# EAGLE design M660A (EAGLE 6.6.0)
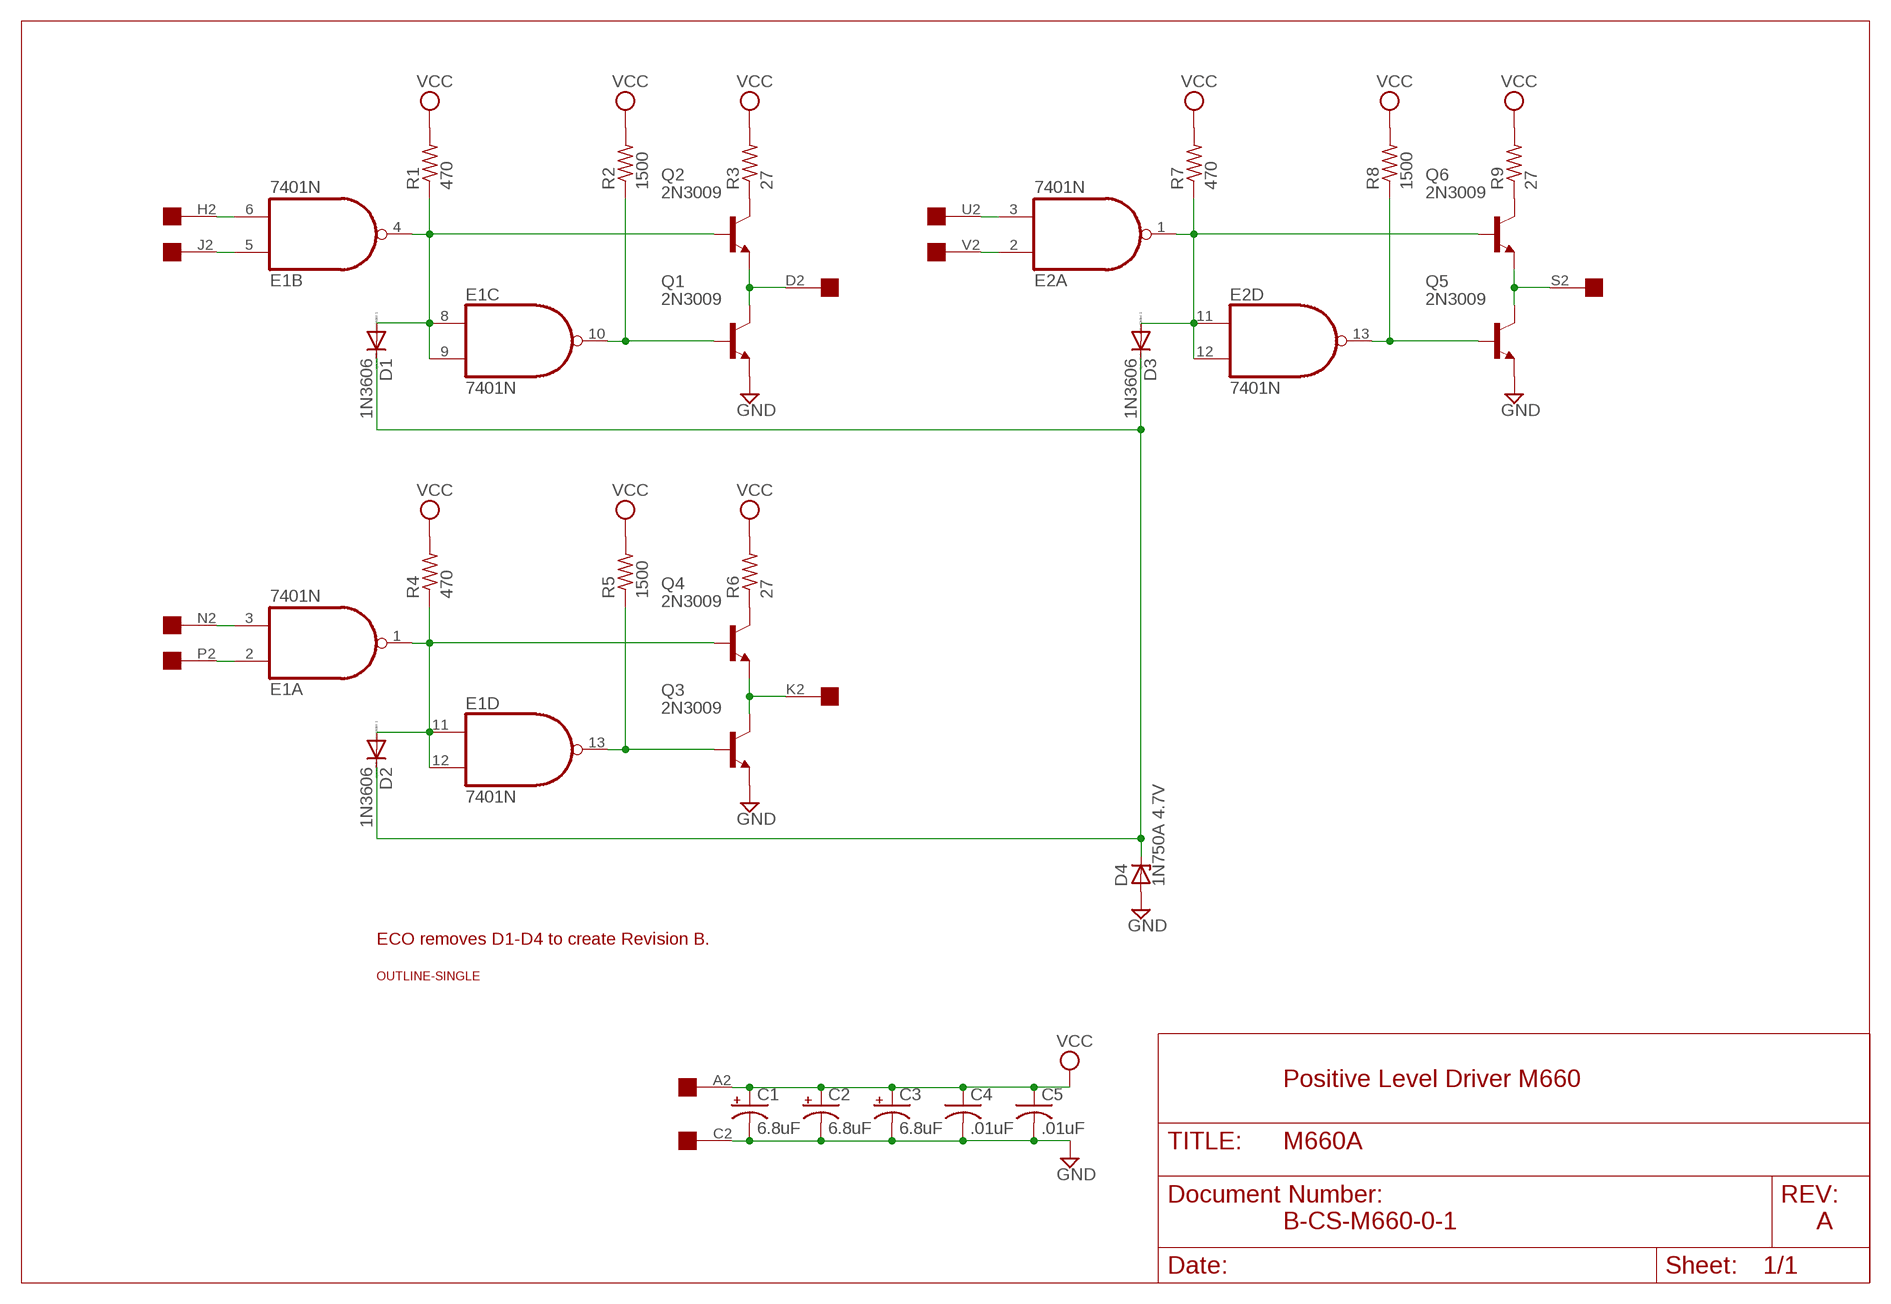
[diagram p0: schematic, sheet 1]

## Parts
C1  6.8uF  CPOL-USE15-5AXIAL  [E15-5]
C2  6.8uF  CPOL-USE15-5AXIAL  [E15-5]
C3  6.8uF  CPOL-USE15-5AXIAL  [E15-5]
C4  .01uF  C-US050-025X075  [C050-025X075]
C5  .01uF  C-US050-025X075  [C050-025X075]
D1  1N3606  1N4148DO35-10  [DO35-10]
D2  1N3606  1N4148DO35-10  [DO35-10]
D3  1N3606  1N4148DO35-10  [DO35-10]
D4  1N750A 4.7V  ZENER-DIODEDO35Z10  [DO35Z10]
E1  7401N  74LS01N  [DIL14]
E2  7401N  74LS01N  [DIL14]
Q1  2N3009  2N2219  [TO5]
Q2  2N3009  2N2219  [TO5]
Q3  2N3009  2N2219  [TO5]
Q4  2N3009  2N2219  [TO5]
Q5  2N3009  2N2219  [TO5]
Q6  2N3009  2N2219  [TO5]
R1  470  R-US_0207/10  [0207/10]
R2  1500  R-US_0207/10  [0207/10]
R3  27  R-US_0411/15  [0411/15]
R4  470  R-US_0207/10  [0207/10]
R5  1500  R-US_0207/10  [0207/10]
R6  27  R-US_0411/15  [0411/15]
R7  470  R-US_0207/10  [0207/10]
R8  1500  R-US_0207/10  [0207/10]
R9  27  R-US_0411/15  [0411/15]
U$1  OUTLINE-SINGLE  [SINGLE]
U$3  EDGE-1  [EDGE-CON1]

## Nets
GND [Supply]: C1.- C2.- C3.- C4.2 C5.2 D4.A Q1.1(E) Q3.1(E) Q5.1(E) U$3.C2
N$1: E1.5(B:I0) U$3.J2
N$2: E1.6(B:I1) U$3.H2
N$3: D1.A E1.4(B:O) E1.8(C:I0) E1.9(C:I1) Q2.2(B) R1.1
N$4: E1.10(C:O) Q1.2(B) R2.1
N$5: Q2.3(C) R3.1
N$6: Q1.3(C) Q2.1(E) U$3.D2
N$7: E1.2(A:I0) U$3.P2
N$8: E1.3(A:I1) U$3.N2
N$9: D2.A E1.1(A:O) E1.11(D:I0) E1.12(D:I1) Q4.2(B) R4.1
N$10: E1.13(D:O) Q3.2(B) R5.1
N$11: Q4.3(C) R6.1
N$12: Q3.3(C) Q4.1(E) U$3.K2
N$13: E2.2(A:I0) U$3.V2
N$14: E2.3(A:I1) U$3.U2
N$15: D3.A E2.1(A:O) E2.11(D:I0) E2.12(D:I1) Q6.2(B) R7.1
N$16: E2.13(D:O) Q5.2(B) R8.1
N$17: Q6.3(C) R9.1
N$18: Q5.3(C) Q6.1(E) U$3.S2
N$19: D1.C D2.C D3.C D4.C
VCC [Supply]: C1.+ C2.+ C3.+ C4.1 C5.1 R1.2 R2.2 R3.2 R4.2 R5.2 R6.2 R7.2 R8.2 R9.2 U$3.A2
Unconnected: E2.4(B:O) E2.5(B:I0) E2.6(B:I1) E2.8(C:I0) E2.9(C:I1) E2.10(C:O) U$3.B2 U$3.E2 U$3.F2 U$3.L2 U$3.M2 U$3.R2 U$3.T2

## Notes on the sheet
- ECO removes D1-D4 to create Revision B.
- Positive Level Driver M660
- B-CS-M660-0-1 | A

## Power pins joined to a net without a drawn wire
GND: E1.7(P:GND) E2.7(P:GND)
VCC: E1.14(P:VCC) E2.14(P:VCC)

## Library data of the parts
C1-C3 = rcl:CPOL-US: POLARIZED CAPACITOR, American symbol
C4 C5 = rcl:C-US: CAPACITOR, American symbol
D1-D3 = diode:1N4148: DIODE high speed (Philips)
D4 = diode:ZENER-DIODE: Z-Diode
E1 E2 = 74xx-us:74*01: Quad 2-input NAND gate, open collector
Q1-Q6 = transistor-npn:2N2219: NPN Transistor
R1-R9 = rcl:R-US_: RESISTOR, American symbol
U$1 = dec-con:OUTLINE-*: Board outlines for DEC boards.
U$3 = dec-con:EDGE-1: Single-Sided DEC Edge Connector -- (side 2)

## Net classes
1 Supply: width 0.813 mm

## Board
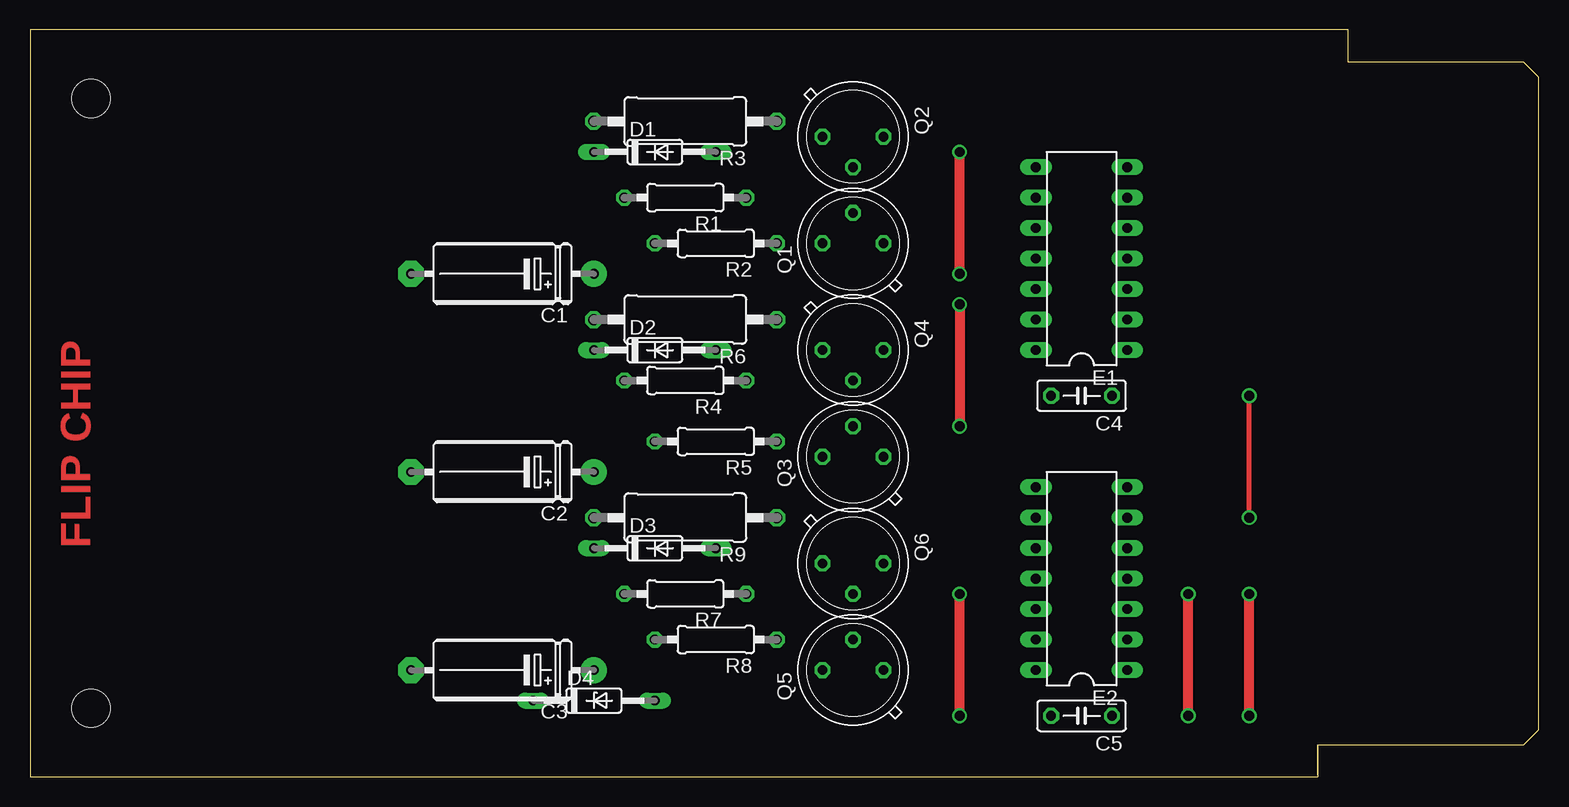
[diagram p1: board, top side]
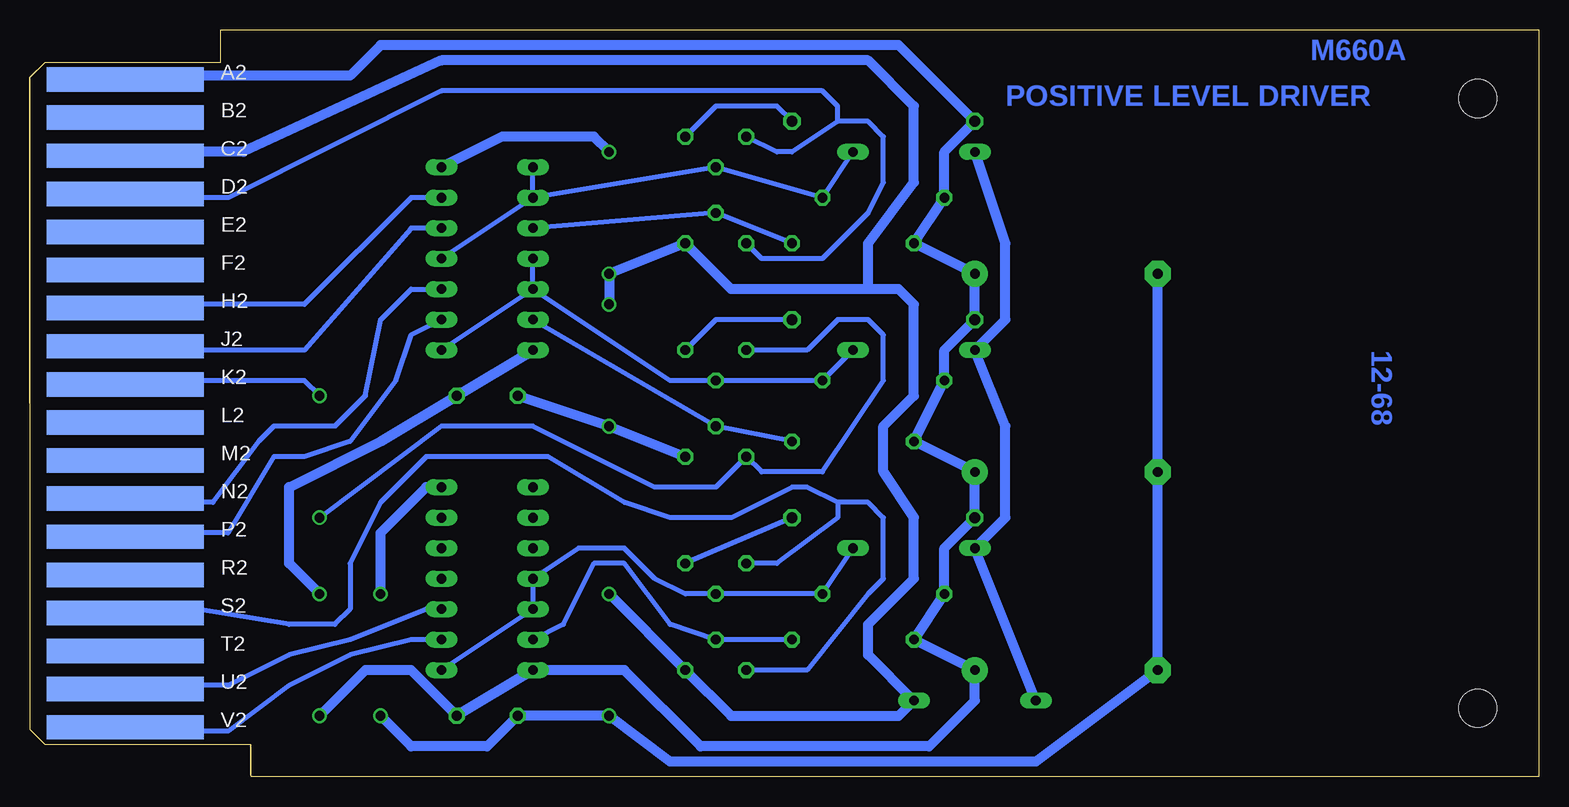
[diagram p2: board, bottom side, seen from below]

Size 125.73 x 62.23 mm. Coordinates in mm from the lower left corner, seen from the top.
Copper layers (1+16): Top 0.035mm / dielectric 1.5mm / Bottom 0.035mm
Design rules "16mils": minimum track width 16mil, minimum drill 32mil, track to track 15mil, track to pad 10mil, pad to pad 10mil, via to via 10mil, smd to smd 10mil, copper to edge 13mil, drill to drill 10mil, minimum pad ring 10mil, minimum via ring 8mil, stop-mask expansion 0mil, vias tented up to drill 0mil, thermal gap 10mil

### Footprints (pad centres in the part's own frame; a part is rotated, then mirrored left to right if it is on the bottom)
E15-5 = drill 0.813 pad 2.159: + -7.62,0 | drill 0.813 pad 2.159 octagon: - 7.62,0
C050-025X075 = drill 0.813 octagon: 1 -2.54,0; 2 2.54,0
DO35-10 = drill 0.813 long: A 5.08,0; C -5.08,0
DO35Z10 = drill 0.813 long: A 5.08,0; C -5.08,0
DIL14 = drill 0.813 long: 1 -7.62,-3.81; 2 -5.08,-3.81; 3 -2.54,-3.81; 4 0,-3.81; 5 2.54,-3.81; 6 5.08,-3.81; 7 7.62,-3.81; 8 7.62,3.81; 9 5.08,3.81; 10 2.54,3.81; 11 0,3.81; 12 -2.54,3.81; 13 -5.08,3.81; 14 -7.62,3.81
TO5 = drill 0.813 octagon: 1 0,-2.54; 2 2.54,0; 3 0,2.54
0207/10 = drill 0.813 octagon: 1 -5.08,0; 2 5.08,0
0411/15 = drill 0.914 octagon: 1 -7.62,0; 2 7.62,0
SINGLE = hole 3.175: 120.65,56.515; 120.65,5.715
EDGE-CON1 = smd 13.106 x 2.032 bottom: A2 7.938,4.128; B2 7.938,7.303; C2 7.938,10.477; D2 7.938,13.652; E2 7.938,16.828; F2 7.938,20.003; H2 7.938,23.177; J2 7.938,26.352; K2 7.938,29.527; L2 7.938,32.703; M2 7.938,35.877; N2 7.938,39.053; P2 7.938,42.227; R2 7.938,45.403; S2 7.938,48.578; T2 7.938,51.752; U2 7.938,54.928; V2 7.938,58.102

### Placement (x,y rotation side)
C1  39.37,41.91 180 top
C2  39.37,25.4 180 top
C3  39.37,8.89 180 top
C4  87.63,31.75 180 top
C5  87.63,5.08 180 top
D1  52.07,52.07 0 top
D2  52.07,35.56 0 top
D3  52.07,19.05 0 top
D4  46.99,6.35 0 top
E1  87.63,43.18 90 top
E2  87.63,16.51 90 top
Q1  68.58,44.45 90 top
Q2  68.58,53.34 270 top
Q3  68.58,26.67 90 top
Q4  68.58,35.56 270 top
Q5  68.58,8.89 90 top
Q6  68.58,17.78 270 top
R1  54.61,48.26 180 top
R2  57.15,44.45 180 top
R3  54.61,54.61 180 top
R4  54.61,33.02 180 top
R5  57.15,27.94 180 top
R6  54.61,38.1 180 top
R7  54.61,15.24 180 top
R8  57.15,11.43 180 top
R9  54.61,21.59 180 top
U$1  125.73,62.23 180 top
U$2  [FLIPCHIP]  0,0 0 top
U$3  125.73,62.23 180 top

### Tracks (layer width: path | path; a pad name or v marks a point on that pad's centre or on a via)
GND  (via drill 0.81)
  Top 0.813: v96.52,5.08 v96.52,15.24 | v77.47,5.08 v77.47,15.24 | v77.47,39.37 v77.47,29.21 | v77.47,41.91 v77.47,52.07
  Bottom 0.813: C1.- C2.- C3.- 41.91,1.27 72.39,1.27 v77.47,5.08 C5.2 87.63,2.54 93.98,2.54 v96.52,5.08 | v77.47,15.24 Q5.1 67.31,5.08 53.34,5.08 D4.A 55.88,10.16 55.88,12.7 52.07,16.51 52.07,21.59 54.61,25.4 54.61,29.21 52.07,31.75 52.07,39.37 53.34,40.64 55.88,40.64 | 55.88,40.64 67.31,40.64 Q1.1 v77.47,41.91 v77.47,39.37 | Q3.1 v77.47,29.21 C4.2 | E1.7 86.36,53.34 78.74,53.34 v77.47,52.07 | U$3.C2 116.84,52.07 107.95,52.07 91.44,59.69 55.88,59.69 52.07,55.88 52.07,49.53 55.88,44.45 55.88,40.64 | E2.7 92.71,24.13 96.52,20.32 v96.52,15.24
N$1
  Bottom 0.406: U$3.J2 116.84,35.56 102.87,35.56 93.98,45.72 E1.5
N$2
  Bottom 0.406: E1.6 93.98,48.26 102.87,39.37 116.84,39.37 U$3.H2
N$3
  Bottom 0.406: D1.A R1.1 Q2.2 E1.9 | E1.9 E1.8 | E1.9 E1.4
N$4
  Bottom 0.406: E1.10 Q1.2 R2.1
N$5
  Bottom 0.406: R3.1 63.5,55.88 68.58,55.88 Q2.3
N$6
  Bottom 0.406: U$3.D2 116.84,48.26 109.22,48.26 91.44,57.15 59.69,57.15 58.42,55.88 58.42,54.61 | 58.42,54.61 62.23,52.07 63.5,52.07 Q2.1 | Q1.3 64.77,43.18 59.69,43.18 55.88,46.99 54.61,49.53 54.61,53.34 55.88,54.61 58.42,54.61
N$7
  Bottom 0.406: U$3.P2 116.84,20.32 109.22,20.32 105.41,26.67 102.87,26.67 99.06,27.94 95.25,33.02 93.98,36.83 E1.2
N$8
  Bottom 0.406: E1.3 93.98,40.64 96.52,38.1 97.79,31.75 100.33,29.21 105.41,29.21 106.68,27.94 110.49,22.86 116.84,22.86 U$3.N2
N$9
  Bottom 0.406: E1.12 E1.11 | E1.12 E1.1 | E1.12 72.39,33.02 Q4.2 R4.1 D2.A
N$10
  Bottom 0.406: R5.1 Q3.2 E1.13
N$11
  Bottom 0.406: R6.1 68.58,38.1 Q4.3
N$12  (via drill 0.81)
  Top 0.406: v101.6,21.59 v101.6,31.75
  Bottom 0.406: U$3.K2 116.84,33.02 102.87,33.02 v101.6,31.75 | v101.6,21.59 91.44,29.21 83.82,29.21 73.66,24.13 68.58,24.13 Q3.3 64.77,25.4 59.69,25.4 54.61,33.02 54.61,36.83 55.88,38.1 58.42,38.1 60.96,35.56 Q4.1
N$13
  Bottom 0.406: U$3.V2 116.84,3.81 109.22,3.81 104.14,7.62 99.06,10.16 93.98,11.43 E2.2
N$14
  Bottom 0.406: E2.3 92.71,13.97 99.06,11.43 104.14,10.16 109.22,7.62 116.84,7.62 U$3.U2
N$15
  Bottom 0.406: D3.A R7.1 Q6.2 71.12,15.24 73.66,16.51 76.2,19.05 80.01,19.05 E2.11 E2.12 E2.1
N$16
  Bottom 0.406: R8.1 Q5.2 72.39,12.7 76.2,17.78 78.74,17.78 81.28,12.7 E2.13
N$17
  Bottom 0.406: R9.1 Q6.3
N$18
  Bottom 0.406: U$3.S2 116.84,13.97 111.76,13.97 104.14,12.7 100.33,12.7 99.06,13.97 99.06,17.78 96.52,22.86 92.71,26.67 82.55,26.67 76.2,22.86 72.39,21.59 67.31,21.59 62.23,24.13 60.96,24.13 58.42,22.86 | Q6.1 63.5,17.78 58.42,21.59 58.42,22.86 | Q5.3 60.96,8.89 55.88,15.24 54.61,16.51 54.61,21.59 55.88,22.86 58.42,22.86
N$19
  Bottom 0.813: D4.C D3.C 44.45,21.59 44.45,29.21 D2.C 44.45,38.1 44.45,44.45 D1.C
VCC  (via drill 0.81)
  Top 0.813: v101.6,5.08 v101.6,15.24
  Bottom 0.813: U$3.A2 117.22,58.04 116.84,58.42 99.06,58.42 96.52,60.96 53.34,60.96 R3.2 49.53,52.07 R1.2 R2.2 C1.+ R6.2 49.53,35.56 R4.2 R5.2 C2.+ R9.2 49.53,19.05 R7.2 R8.2 C3.+ 46.99,6.35 50.8,2.54 69.85,2.54 76.2,8.89 E2.14 C5.1 93.98,8.89 97.79,8.89 v101.6,5.08 | E1.14 C4.1 96.52,27.94 104.14,24.13 104.14,17.78 v101.6,15.24

### Text on the board
Bottom: M660A | POSITIVE LEVEL DRIVER | 12-68